# Altium project Logic_Gates_4.PrjPcb (part 1 of 2)
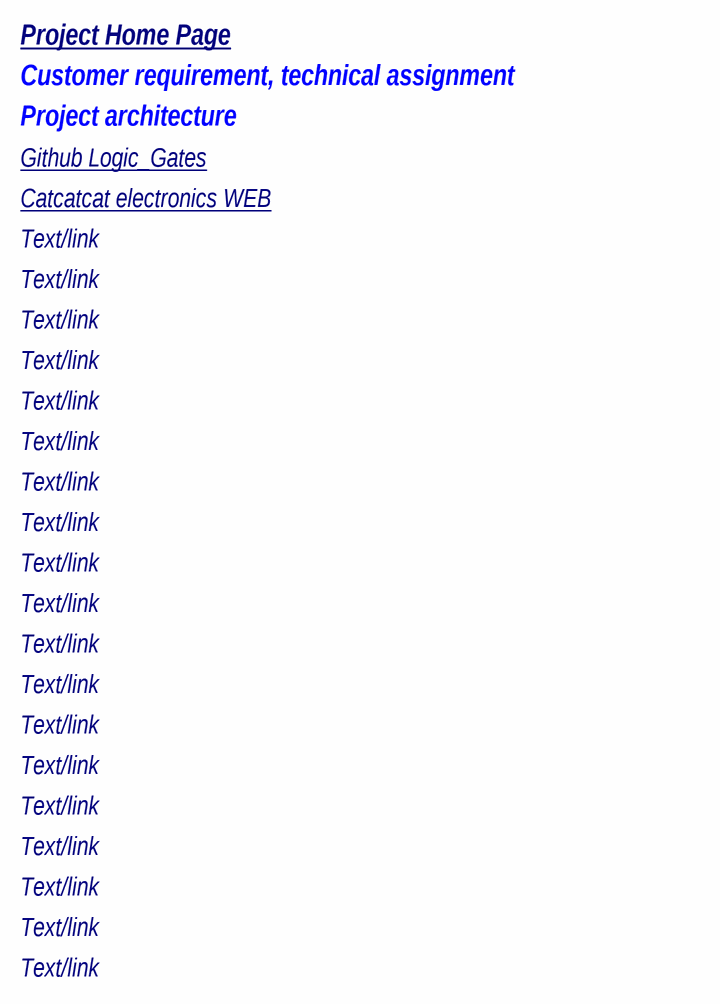
[diagram p0: Additional Documents.SchDoc]
Svia_covering: Tented; SSurfaceFinish: HASL (with lead); SSolderMaskColor: Green; SSilkscreeColor: While; SPCB_Qty: 5; SMaterialPCB: FR4-Standart TG 135-140; SFinisOverallThickness: 1.6; SboardOutlineTolerance: 0.2mm(Regular); PRJ_Year: 2024; PRJ_Version: 00B1; PRJ_Title: LogicGates4; PRJ_ID: =PRJ_Year+'-'+PRJ_Title+'-'+PRJ_Version+'-'+PCB_Name+'-R'+PCB_Revision; PCB_Revision: 04; PCB_Name: PCB; Note: Note; Lead_PRJ: Lead_Catcatcat; Inspection_PRJ: Ins_Catcatcat; Engineer_SCH: SCH_Catcatcat; Engineer_PCB: PCB_Catcatcat; Customer_PRJ: Catcatcat Etsy; AddressTelephone: +380 50 575-98-63; AddressEmail: catcatcat.electronics@gmail.com; AddressCompanyDeveloper: Catcatcat Electronics; AddressCompany: Ukraine, Dnipro, Avenue Mira
9 sheets, 163 parts. Net scope: hierarchical (ports join the sheet entries above them; power ports are global).
Board file: PCB.PcbDoc
Sheets:
  Additional Documents.SchDoc
  Assembly.SchDoc
  Table Of Contents.SchDoc
  Functional Diagram.SchDoc
    Display = Display.SchDoc
    MCU = MCU.SchDoc
    Touch Sensors = Touch Sensors.SchDoc
    Sound = Sound.SchDoc
    Power = USB Power.SchDoc

## Sheet Additional Documents.SchDoc: =ProjectName
size A3; CodePhone: +380505759863; Author: Hena Chernov; CompanyName: Catcatcat Electronics; Organization: Catcatcat Electronics; SheetNumber: 2; SheetTotal: 10; SheetDescription: Links to additional project documents.; Email: catcatcat.electronics@gmail.com

### Notes on the sheet
- Project Home Page <https://catcatcat.d-lan.dp.ua/>
- Project architecture
- Customer requirement, technical assignment
- Github Logic_Gates <https://github.com/CatcatcatElectronics/Logic_Gates>
- Catcatcat electronics WEB <https://catcatcat.d-lan.dp.ua/>
- Text/link
- Document's name/Назва документу (Document link)
- Note: Links to additional technical documents used in the project.
- Project Title:
- Project Version:
- Designed for:
- Lead Project
- Project ID:
- Development company
- Date:
- PCB Revision:
- PCB Name:
- Sheet Title:
- Assembly Variant:
- Time:
- Sheet
- of
- Engineer SCH:
- Engineer PCB:
- Inspection PRJ:
- Size: A3
- File:

## Sheet Assembly.SchDoc: =ProjectName
size A4; Author: Hena Chernov; CompanyName: Catcatcat Electronics; Engineer: Hena Chernov; Organization: Catcatcat Electronics; SheetNumber: 3; SheetTotal: 10; CodePhone: +380505759863; SheetDescription: Board Assembly Components
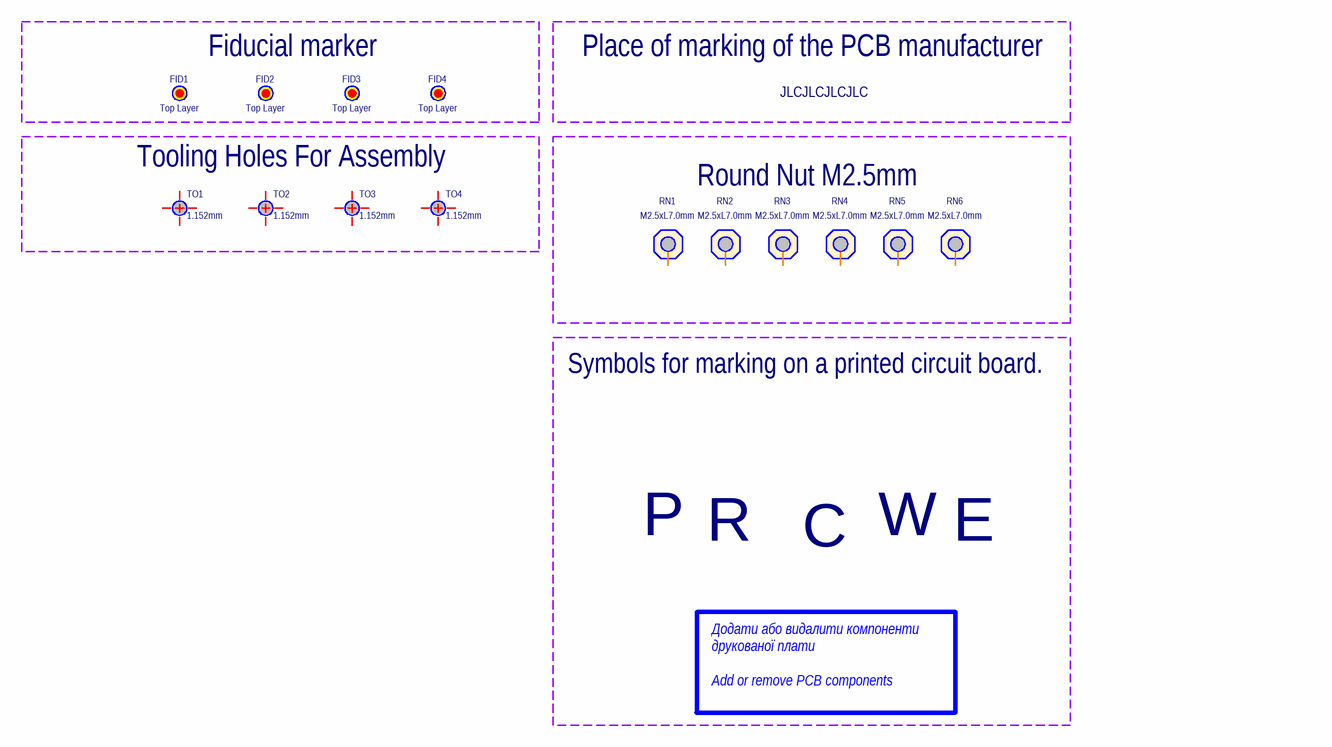
[diagram p1: Assembly.SchDoc]

### Parts
FID1  value Top Layer  [Fiducial marker top]  (hidden comment: Top(Bottom) Layer)  (no BOM)
FID2  value Top Layer  [Fiducial marker top]  (hidden comment: Top(Bottom) Layer)  (no BOM)
FID3  value Top Layer  [Fiducial marker top]  (hidden comment: Top(Bottom) Layer)  (no BOM)
FID4  value Top Layer  [Fiducial marker top]  (hidden comment: Top(Bottom) Layer)  (no BOM)
GS2  Graphic symbol  [_S_JLC]  (value not drawn)  (no BOM)
GS3  Graphic symbol  [_S_Pb-free]  (value not drawn)  (no BOM)
GS4  Graphic symbol  [_S_TR]  (value not drawn)  (no BOM)
GS5  Graphic symbol  [_S_R]  (value not drawn)  (no BOM)
GS6  Graphic symbol  [_S_ATTENTION2]  (value not drawn)  (no BOM)
GS7  Graphic symbol  [_S_CE]  (value not drawn)  (no BOM)
RN1  value M2.5xL7.0mm  [NUT2.5xL7.0]  (hidden comment: SMTSO2570CTJ)
RN2  value M2.5xL7.0mm  [NUT2.5xL7.0]  (hidden comment: SMTSO2570CTJ)
RN3  value M2.5xL7.0mm  [NUT2.5xL7.0]  (hidden comment: SMTSO2570CTJ)
RN4  value M2.5xL7.0mm  [NUT2.5xL7.0]  (hidden comment: SMTSO2570CTJ)
RN5  value M2.5xL7.0mm  [NUT2.5xL7.0]  (hidden comment: SMTSO2570CTJ)
RN6  value M2.5xL7.0mm  [NUT2.5xL7.0]  (hidden comment: SMTSO2570CTJ)
TO1  1.152mm  [Tooling_Holes_1.152MM]  (no BOM)
TO2  1.152mm  [Tooling_Holes_1.152MM]  (no BOM)
TO3  1.152mm  [Tooling_Holes_1.152MM]  (no BOM)
TO4  1.152mm  [Tooling_Holes_1.152MM]  (no BOM)

### Blocks framed on the sheet
Fiducial marker: FID1-FID4
Place of marking of the PCB manufacturer: GS2
Tooling Holes For Assembly: TO1-TO4
Round Nut M2.5mm: RN1-RN6
Symbols for marking on a printed circuit board.: GS3-GS7

### Nets

Not connected (* = marked no-connect by the designer): FID1 1; FID2 1; FID3 1; FID4 1; RN1 1; RN2 1; RN3 1; RN4 1; RN5 1; RN6 1; TO1 1; TO2 1; TO3 1; TO4 1

### Notes on the sheet
- Додати або видалити компоненти друкованої плати
  Add or remove PCB components
- Project Title:
- Project Version:
- Designed for:
- Lead Project
- Project ID:
- Development company
- Date:
- PCB Revision:
- PCB Name:
- Sheet Title:
- Assembly Variant:
- Time:
- Sheet
- of
- Engineer SCH:
- Engineer PCB:
- Inspection PRJ:
- Size: A4
- File:
- (in symbol _S_ATTENTION2) E
- (in symbol _S_JLC) JLCJLCJLCJLC
- (in symbol _S_PF) P
- (in symbol _S_R) R
- (in symbol _S_SE) C
- (in symbol _S_TR) W

### Library data of the parts
FID1-FID4 = Fiducial marker Top: For Assembly Top(Bottom) Layer; Assembly type: Fiducial Marker; Manufacturer Part Number 1: Fiducial Marker; Note: Fiducial marker; Case/Package: Fiducial Marker; Publisher: Catcatcat Electronics; Website developer: http://catcatcat.d-lan.dp.ua/; Footprint check status: Verified; Supplier URL 1: https://jlcpcb.com/parts/componentSearch?searchTxt=; Supplier 1: LCSC
GS2 = _S_JLC: Graphic symbol for marking on a PCB; Value: *; Assembly type: Graphic symbol; Note: Graphic symbol; Publisher: Catcatcat Electronics; Website developer: http://catcatcat.d-lan.dp.ua/; Footprint check status: Verified; Manufacturer Part Number 1: Graphic symbol; Case/Package: Graphic symbol; Supplier URL 1: https://jlcpcb.com/parts/componentSearch?searchTxt=
GS3 = _S_PF: Graphic symbol for marking on a PCB; Value: *; Assembly type: Graphic symbol; Note: Graphic symbol; Publisher: Catcatcat Electronics; Website developer: http://catcatcat.d-lan.dp.ua/; Footprint check status: Verified; Manufacturer Part Number 1: Graphic symbol; Case/Package: Graphic symbol; Supplier URL 1: https://jlcpcb.com/parts/componentSearch?searchTxt=
GS4 = _S_TR: Graphic symbol for marking on a PCB; Value: *; Assembly type: Graphic symbol; Note: Graphic symbol; Publisher: Catcatcat Electronics; Website developer: http://catcatcat.d-lan.dp.ua/; Footprint check status: Verified; Manufacturer Part Number 1: Graphic symbol; Case/Package: Graphic symbol; Supplier URL 1: https://jlcpcb.com/parts/componentSearch?searchTxt=
GS5 = _S_R: Graphic symbol for marking on a PCB; Value: *; Assembly type: Graphic symbol; Note: Graphic symbol; Publisher: Catcatcat Electronics; Website developer: http://catcatcat.d-lan.dp.ua/; Footprint check status: Verified; Manufacturer Part Number 1: Graphic symbol; Case/Package: Graphic symbol; Supplier URL 1: https://jlcpcb.com/parts/componentSearch?searchTxt=
GS6 = _S_ATTENTION2: Graphic symbol for marking on a PCB; Value: *; Assembly type: Graphic symbol; Note: Graphic symbol; Publisher: Catcatcat Electronics; Website developer: http://catcatcat.d-lan.dp.ua/; Footprint check status: Verified; Manufacturer Part Number 1: Graphic symbol; Case/Package: Graphic symbol; Supplier URL 1: https://jlcpcb.com/parts/componentSearch?searchTxt=
GS7 = _S_SE: Graphic symbol for marking on a PCB; Value: *; Assembly type: Graphic symbol; Note: Graphic symbol; Publisher: Catcatcat Electronics; Website developer: http://catcatcat.d-lan.dp.ua/; Footprint check status: Verified; Manufacturer Part Number 1: Graphic symbol; Case/Package: Graphic symbol; Supplier URL 1: https://jlcpcb.com/parts/componentSearch?searchTxt=
RN1-RN6 = Round Nut M2.5xL7.0S (E): Nuts Tinning Copper, M2.5 Round Nut L7.0mm; Manufacturer 1: Sinhoo; Detailed Description: Round Nut M2.5x5.56xLxx+1.53  Nuts ROHS; Assembly type: Extended Part; HelpURL: https://datasheet.lcsc.com/lcsc/2112061830_Sinhoo-SMTSO2570CTJ_C2916328.pdf; Manufacturer Part Number 1: SMTSO2570CTJ; Note: Round Nut; Case/Package: SMD-M2.5x5.56xLxx+1.53; Supplier Part Number 1: C2916328; Supplier Unit Price 1: 0.0965; Publisher: Catcatcat Electronics; Website developer: http://catcatcat.d-lan.dp.ua/; Footprint check status: Verified; Supplier URL 1: https://www.lcsc.com/product-detail/SMD-round-nut_Sinhoo-SMTSO2570CTJ_C2916328.html; Supplier 1: LCSC; MountType: SMD+TH
TO1-TO4 = Tooling_Holes_1.152MM: For Assembly; Note: Tooling Hole; Assembly type: Tooling Hole; Case/Package: Tooling Hole 1.152mm; Publisher: Catcatcat Electronics; Website developer: http://catcatcat.d-lan.dp.ua/; Footprint check status: Verified; Supplier URL 1: https://jlcpcb.com/parts/componentSearch?searchTxt=; Supplier 1: LCSC; Value: 1.152mm

## Sheet Table Of Contents.SchDoc: =ProjectName
size A4; CompanyName: Catcatcat Electronics; Engineer: Hena Chernov; Organization: Catcatcat Electronics; SheetNumber: 4; SheetTotal: 10; CodePhone: +380505759863; SheetDescription: List of project sheets.; Email: catcatcat.electronics@gmail.com
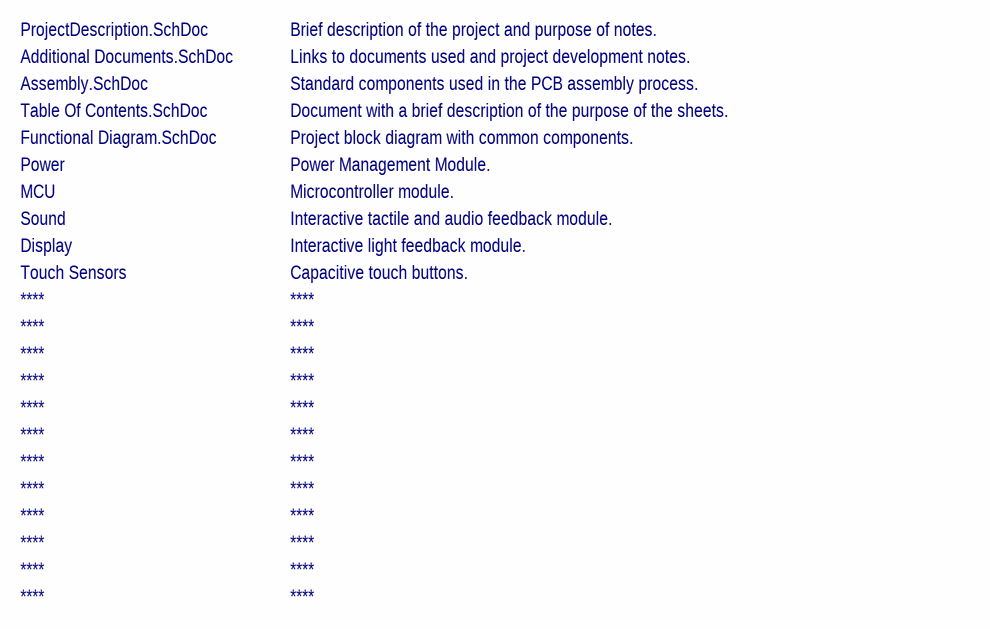
[diagram p2: Table Of Contents.SchDoc]

### Notes on the sheet
- Additional Documents.SchDoc
- ProjectDescription.SchDoc
- Links to documents used and project development notes.
- Brief description of the project and purpose of notes.
- Table Of Contents.SchDoc
- Assembly.SchDoc
- Document with a brief description of the purpose of the sheets.
- Standard components used in the PCB assembly process.
- Power
- MCU
- Functional Diagram.SchDoc
- Power Management Module.
- Microcontroller module.
- Project block diagram with common components.
- Sound
- Display
- Interactive tactile and audio feedback module.
- Interactive light feedback module.
- Touch Sensors
- ****
- Capacitive touch buttons.
- TABLE OF CONTENTS
- Sheet NO:
- Sheet name
- Notes
- 1
- 2
- 3
- 4
- 5
- 7
- 6
- 8
- 9
- 10
- 11
- 12
- 13
- 14
- 15
- 16
- 17
- 18
- 19
- 20
- 21
- 22
- Project Title:
- Project Version:
- Designed for:
- Lead Project
- Project ID:
- Development company
- Date:
- PCB Revision:
- PCB Name:
- Sheet Title:
- Assembly Variant:
- Time:
- Sheet
- of
- Engineer SCH:
- Engineer PCB:
- Inspection PRJ:
- Size: A4
- File:

## Sheet Functional Diagram.SchDoc: =ProjectName
size A3; Author: Hena Chernov; CompanyName: Catcatcat Electronics; Engineer: Hena Chernov; Organization: Catcatcat Electronics; SheetNumber: 5; SheetTotal: 10; CodePhone: +380505759863; SheetDescription: Project flowchart.; Email: catcatcat.electronics@gmail.com
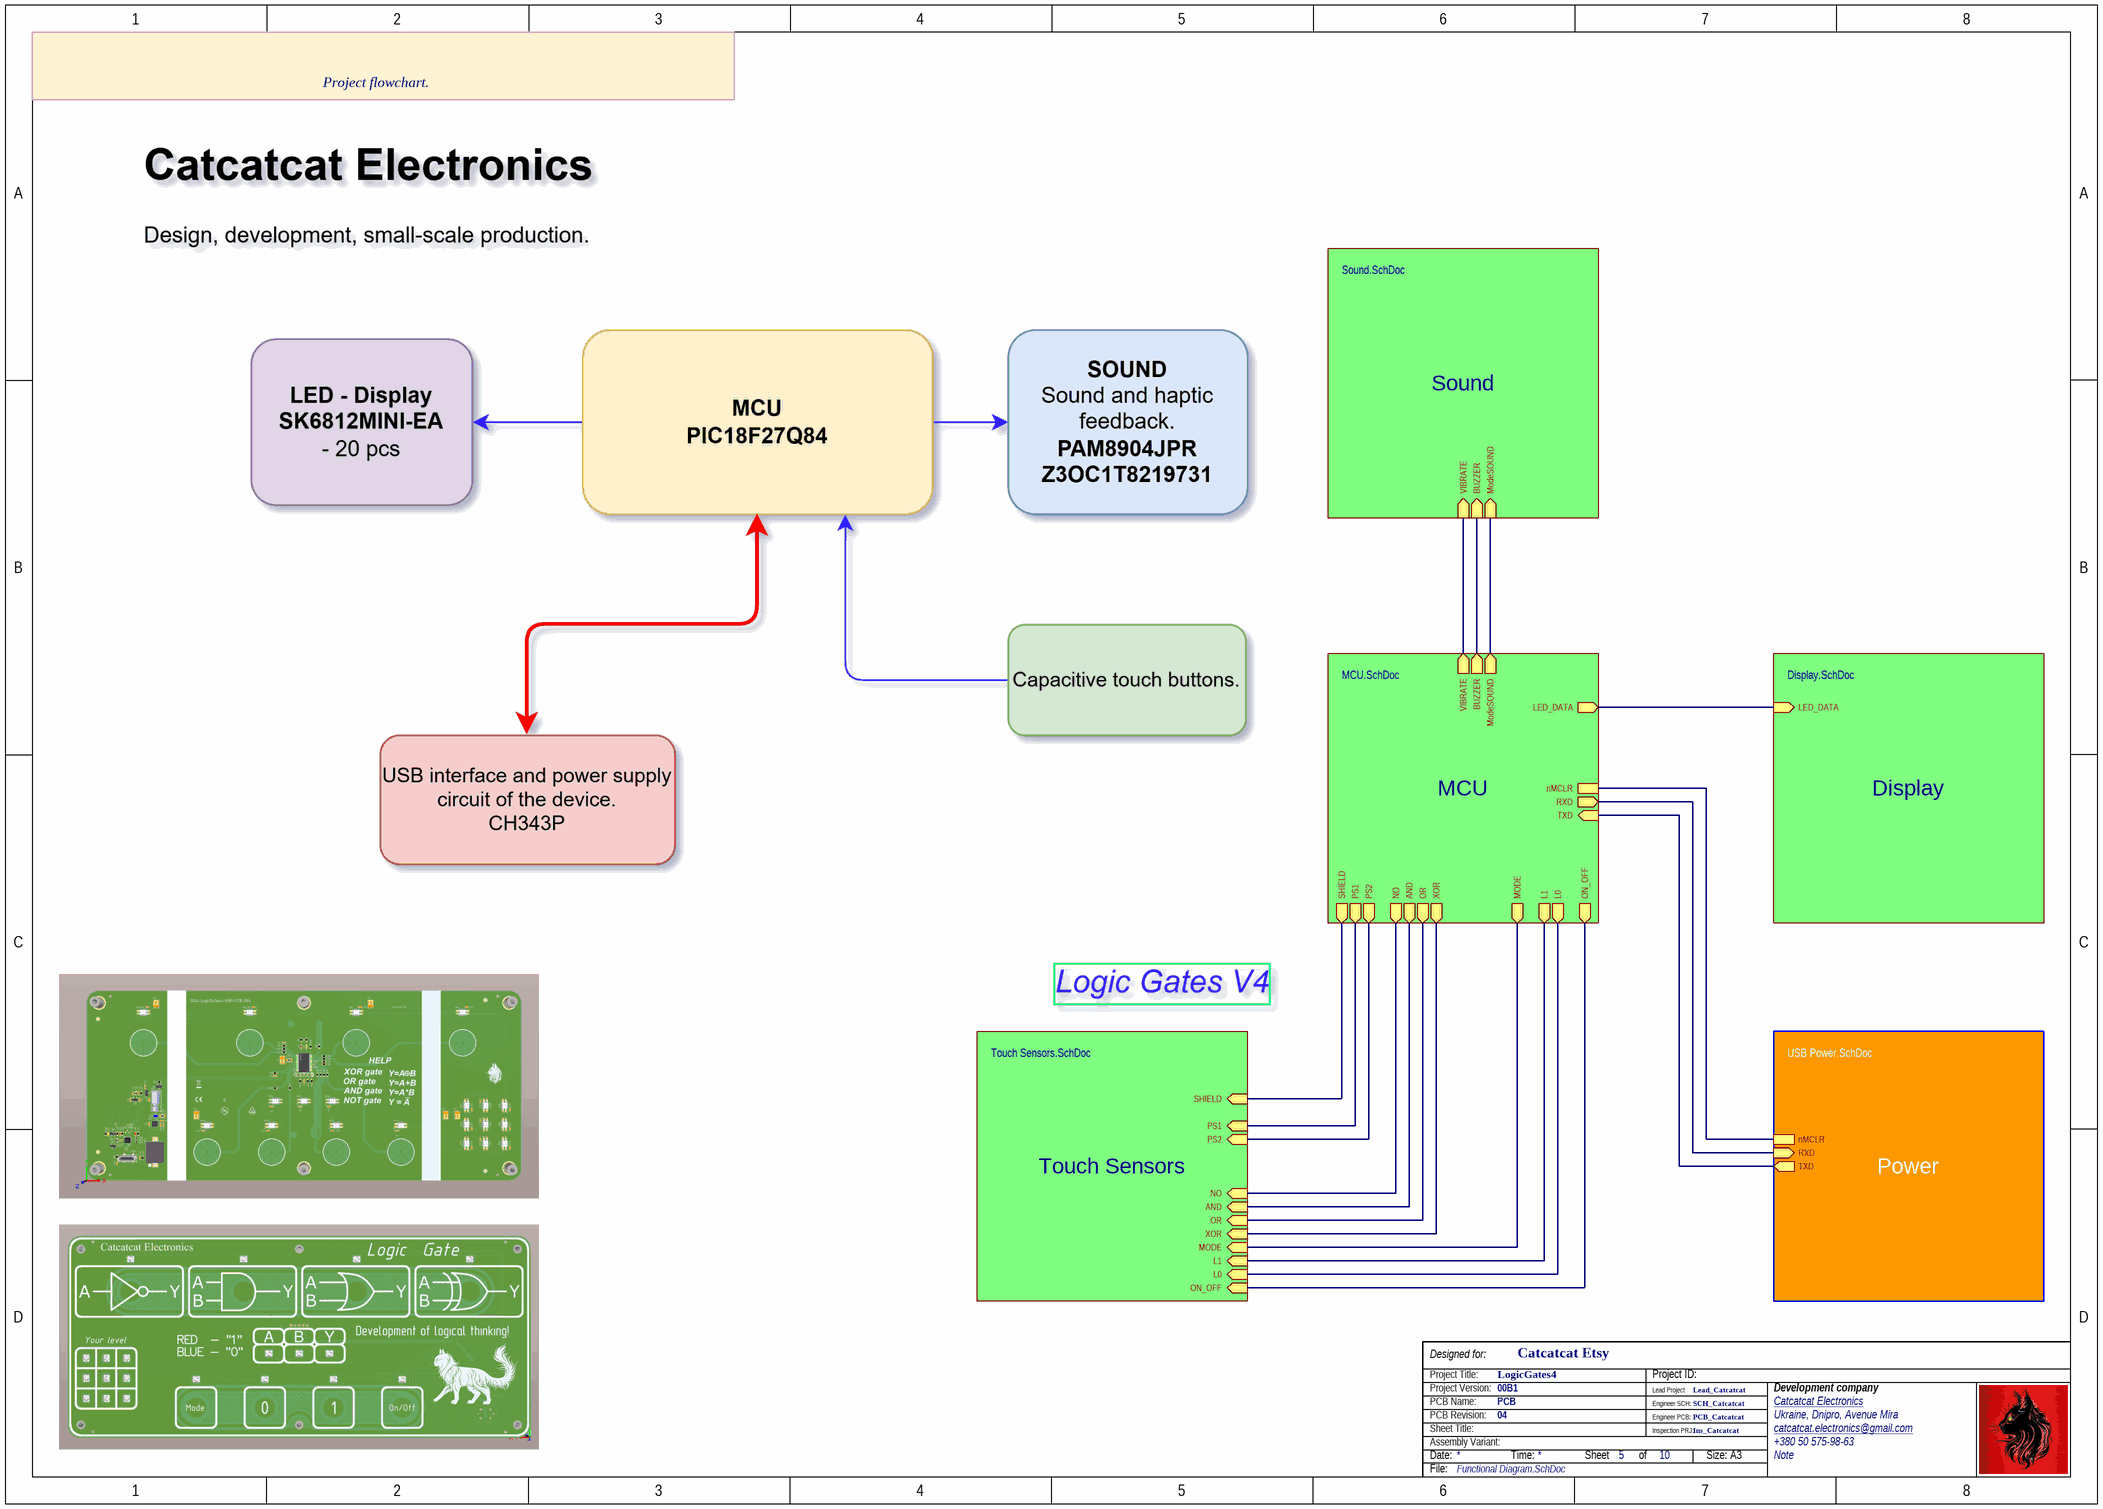
[diagram p3: Functional Diagram.SchDoc]

### Sub-sheets
Display = Display.SchDoc: LED_DATA (in)
MCU = MCU.SchDoc: BUZZER (out), VIBRATE (out), LED_DATA (out), NO (out), AND (out), OR (out), XOR (out), MODE (out), L1 (out), L0 (out), ON_OFF (out), SHIELD (out), PS1 (out), PS2 (out), ModeSOUND (out), nMCLR, RXD (out), TXD (in)
Power = USB Power.SchDoc: RXD (in), nMCLR, TXD (out)
Sound = Sound.SchDoc: BUZZER (in), VIBRATE (in), ModeSOUND (in)
Touch Sensors = Touch Sensors.SchDoc: NO (in), AND (in), OR (in), XOR (in), MODE (in), L1 (in), L0 (in), ON_OFF (in), SHIELD (in), PS1 (in), PS2 (in)

### Nets
AND: sheet MCU/AND, sheet Touch Sensors/AND
BUZZER: sheet MCU/BUZZER, sheet Sound/BUZZER
L0: sheet MCU/L0, sheet Touch Sensors/L0
L1: sheet MCU/L1, sheet Touch Sensors/L1
LED_DATA: sheet Display/LED_DATA, sheet MCU/LED_DATA
MODE: sheet MCU/MODE, sheet Touch Sensors/MODE
ModeSOUND: sheet MCU/ModeSOUND, sheet Sound/ModeSOUND
nMCLR: sheet MCU/nMCLR, sheet Power/nMCLR
NO: sheet MCU/NO, sheet Touch Sensors/NO
ON_OFF: sheet MCU/ON_OFF, sheet Touch Sensors/ON_OFF
OR: sheet MCU/OR, sheet Touch Sensors/OR
PS1: sheet MCU/PS1, sheet Touch Sensors/PS1
PS2: sheet MCU/PS2, sheet Touch Sensors/PS2
RXD: sheet MCU/RXD, sheet Power/RXD
SHIELD: sheet MCU/SHIELD, sheet Touch Sensors/SHIELD
TXD: sheet MCU/TXD, sheet Power/TXD
VIBRATE: sheet MCU/VIBRATE, sheet Sound/VIBRATE
XOR: sheet MCU/XOR, sheet Touch Sensors/XOR

### Notes on the sheet
- Project Title:
- Project Version:
- Designed for:
- Lead Project
- Project ID:
- Development company
- Date:
- PCB Revision:
- PCB Name:
- Sheet Title:
- Assembly Variant:
- Time:
- Sheet
- of
- Engineer SCH:
- Engineer PCB:
- Inspection PRJ:
- Size: A3
- File:

## Sheet Display.SchDoc: =SheetTitle
size A4; CompanyName: Catcatcat Electronics; Engineer: Hena Chernov; Organization: Catcatcat Electronics; SheetNumber: 8; SheetTotal: 10; CodePhone: +380505759863; SheetDescription: Interactive light feedback module.; Email: catcatcat.electronics@gmail.com
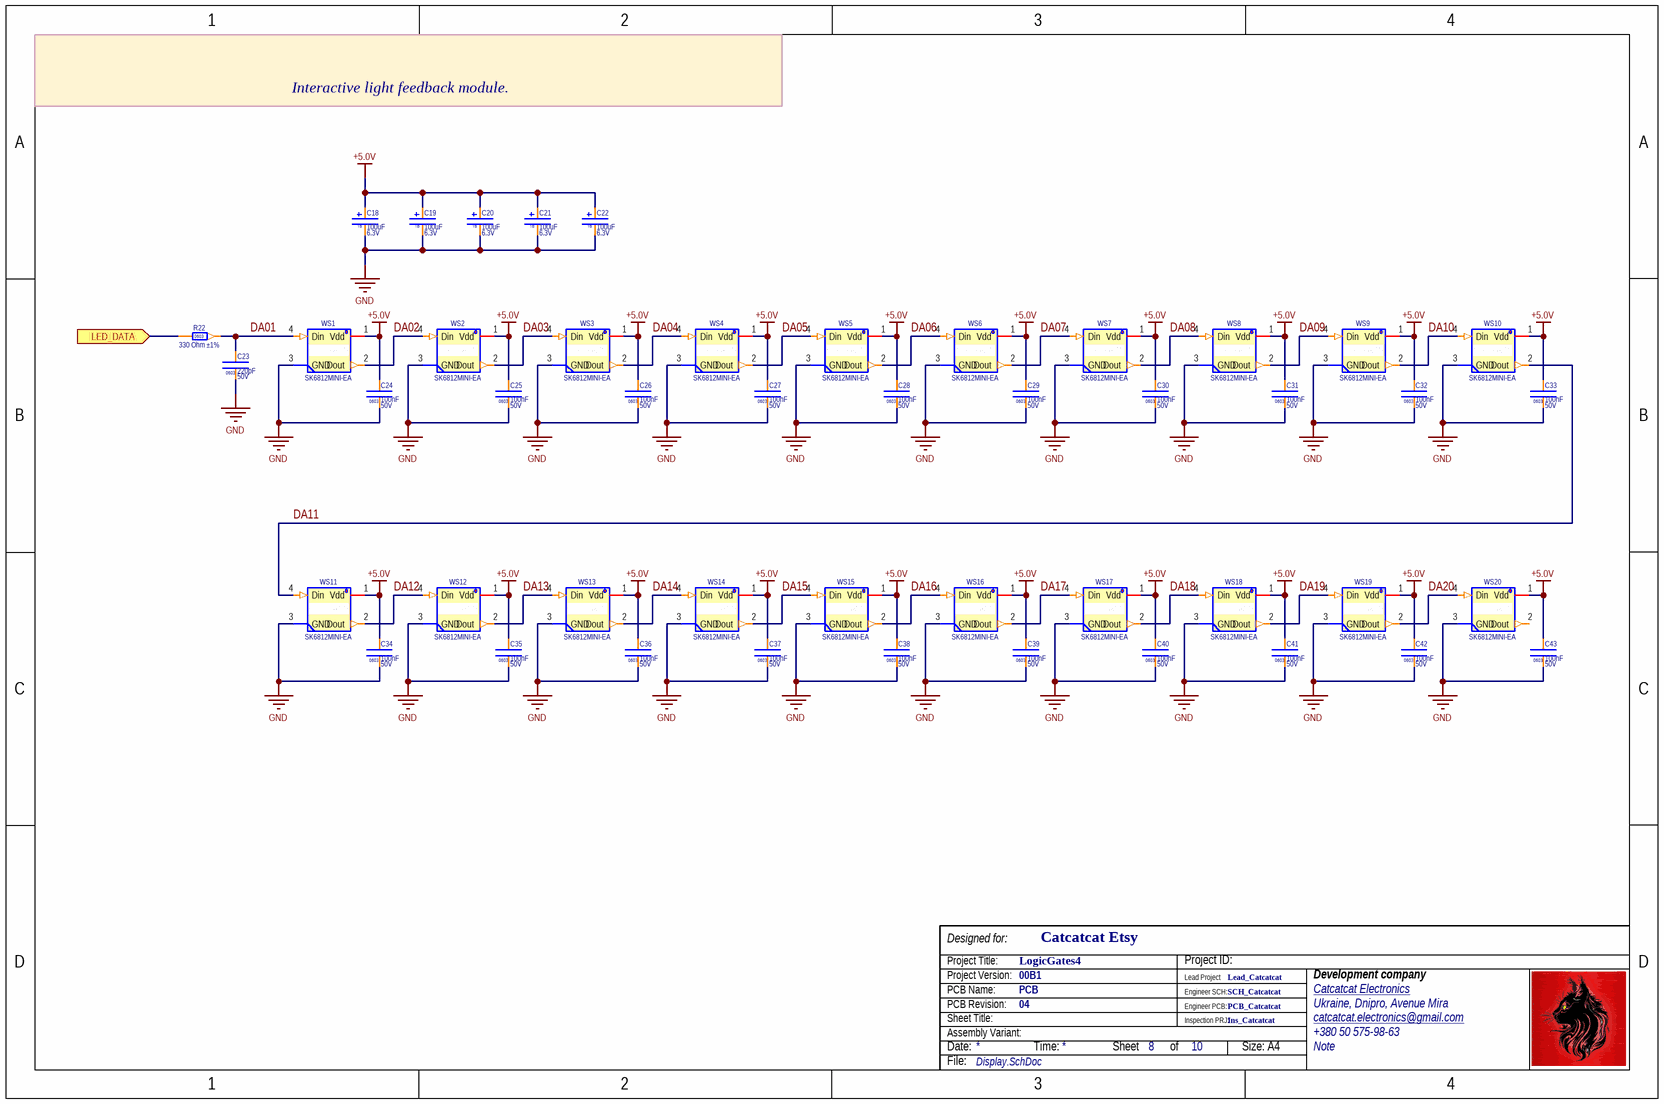
[diagram p4: Display.SchDoc]

### Parts
C18  value 100uF  Voltage: 6.3V  [TANTAL_B]  (hidden comment: 100UF 6.3V CASE-B_3528)
C19  value 100uF  Voltage: 6.3V  [TANTAL_B]  (hidden comment: 100UF 6.3V CASE-B_3528)
C20  value 100uF  Voltage: 6.3V  [TANTAL_B]  (hidden comment: 100UF 6.3V CASE-B_3528)
C21  value 100uF  Voltage: 6.3V  [TANTAL_B]  (hidden comment: 100UF 6.3V CASE-B_3528)
C22  value 100uF  Voltage: 6.3V  [TANTAL_B]  (hidden comment: 100UF 6.3V CASE-B_3528)
C23  value 220pF  Voltage: 50V  [CC0603(1608)x0.8]  (hidden comment: 220 pF ±10%)
C24  value 100nF  Voltage: 50V  [CC0603(1608)x0.8]  (hidden comment: 100 nF ±10% 50V)
C25  value 100nF  Voltage: 50V  [CC0603(1608)x0.8]  (hidden comment: 100 nF ±10% 50V)
C26  value 100nF  Voltage: 50V  [CC0603(1608)x0.8]  (hidden comment: 100 nF ±10% 50V)
C27  value 100nF  Voltage: 50V  [CC0603(1608)x0.8]  (hidden comment: 100 nF ±10% 50V)
C28  value 100nF  Voltage: 50V  [CC0603(1608)x0.8]  (hidden comment: 100 nF ±10% 50V)
C29  value 100nF  Voltage: 50V  [CC0603(1608)x0.8]  (hidden comment: 100 nF ±10% 50V)
C30  value 100nF  Voltage: 50V  [CC0603(1608)x0.8]  (hidden comment: 100 nF ±10% 50V)
C31  value 100nF  Voltage: 50V  [CC0603(1608)x0.8]  (hidden comment: 100 nF ±10% 50V)
C32  value 100nF  Voltage: 50V  [CC0603(1608)x0.8]  (hidden comment: 100 nF ±10% 50V)
C33  value 100nF  Voltage: 50V  [CC0603(1608)x0.8]  (hidden comment: 100 nF ±10% 50V)
C34  value 100nF  Voltage: 50V  [CC0603(1608)x0.8]  (hidden comment: 100 nF ±10% 50V)
C35  value 100nF  Voltage: 50V  [CC0603(1608)x0.8]  (hidden comment: 100 nF ±10% 50V)
C36  value 100nF  Voltage: 50V  [CC0603(1608)x0.8]  (hidden comment: 100 nF ±10% 50V)
C37  value 100nF  Voltage: 50V  [CC0603(1608)x0.8]  (hidden comment: 100 nF ±10% 50V)
C38  value 100nF  Voltage: 50V  [CC0603(1608)x0.8]  (hidden comment: 100 nF ±10% 50V)
C39  value 100nF  Voltage: 50V  [CC0603(1608)x0.8]  (hidden comment: 100 nF ±10% 50V)
C40  value 100nF  Voltage: 50V  [CC0603(1608)x0.8]  (hidden comment: 100 nF ±10% 50V)
C41  value 100nF  Voltage: 50V  [CC0603(1608)x0.8]  (hidden comment: 100 nF ±10% 50V)
C42  value 100nF  Voltage: 50V  [CC0603(1608)x0.8]  (hidden comment: 100 nF ±10% 50V)
C43  value 100nF  Voltage: 50V  [CC0603(1608)x0.8]  (hidden comment: 100 nF ±10% 50V)
R22  value 330 Ohm ±1%  [RC0603(1608) -1%]  (hidden comment: 330 R ±1%)
WS1  SK6812MINI-EA  [SK6812MINI-EA - 1MM]
WS2  SK6812MINI-EA  [SK6812MINI-EA - 1MM]
WS3  SK6812MINI-EA  [SK6812MINI-EA - 1MM]
WS4  SK6812MINI-EA  [SK6812MINI-EA - 1MM]
WS5  SK6812MINI-EA  [SK6812MINI-EA - 1MM]
WS6  SK6812MINI-EA  [SK6812MINI-EA - 1MM]
WS7  SK6812MINI-EA  [SK6812MINI-EA - 1MM]
WS8  SK6812MINI-EA  [SK6812MINI-EA - 1MM]
WS9  SK6812MINI-EA  [SK6812MINI-EA - 1MM]
WS10  SK6812MINI-EA  [SK6812MINI-EA - 1MM]
WS11  SK6812MINI-EA  [SK6812MINI-EA - 1MM]
WS12  SK6812MINI-EA  [SK6812MINI-EA - 1MM]
WS13  SK6812MINI-EA  [SK6812MINI-EA - 1MM]
WS14  SK6812MINI-EA  [SK6812MINI-EA - 1MM]
WS15  SK6812MINI-EA  [SK6812MINI-EA - 1MM]
WS16  SK6812MINI-EA  [SK6812MINI-EA - 1MM]
WS17  SK6812MINI-EA  [SK6812MINI-EA - 1MM]
WS18  SK6812MINI-EA  [SK6812MINI-EA - 1MM]
WS19  SK6812MINI-EA  [SK6812MINI-EA - 1MM]
WS20  SK6812MINI-EA  [SK6812MINI-EA - 1MM]

### Ports
LED_DATA (in)

### Nets
+5.0V: C18.1 C19.1 C20.1 C21.1 C22.1 C24.2 C25.2 C26.2 C27.2 C28.2 C29.2 C30.2 C31.2 C32.2 C33.2 C34.2 C35.2 C36.2 C37.2 C38.2 C39.2 C40.2 C41.2 C42.2 C43.2 WS1.1(Vdd) WS2.1(Vdd) WS3.1(Vdd) WS4.1(Vdd) WS5.1(Vdd) WS6.1(Vdd) WS7.1(Vdd) WS8.1(Vdd) WS9.1(Vdd) WS10.1(Vdd) WS11.1(Vdd) WS12.1(Vdd) WS13.1(Vdd) WS14.1(Vdd) WS15.1(Vdd) WS16.1(Vdd) WS17.1(Vdd) WS18.1(Vdd) WS19.1(Vdd) WS20.1(Vdd)
GND: C18.2 C19.2 C20.2 C21.2 C22.2 C23.1 C24.1 C25.1 C26.1 C27.1 C28.1 C29.1 C30.1 C31.1 C32.1 C33.1 C34.1 C35.1 C36.1 C37.1 C38.1 C39.1 C40.1 C41.1 C42.1 C43.1 WS1.3(GND) WS2.3(GND) WS3.3(GND) WS4.3(GND) WS5.3(GND) WS6.3(GND) WS7.3(GND) WS8.3(GND) WS9.3(GND) WS10.3(GND) WS11.3(GND) WS12.3(GND) WS13.3(GND) WS14.3(GND) WS15.3(GND) WS16.3(GND) WS17.3(GND) WS18.3(GND) WS19.3(GND) WS20.3(GND)
DA01: C23.2 R22.2 WS1.4(Din)
DA02: WS1.2(Dout) WS2.4(Din)
DA03: WS2.2(Dout) WS3.4(Din)
DA04: WS3.2(Dout) WS4.4(Din)
DA05: WS4.2(Dout) WS5.4(Din)
DA06: WS5.2(Dout) WS6.4(Din)
DA07: WS6.2(Dout) WS7.4(Din)
DA08: WS7.2(Dout) WS8.4(Din)
DA09: WS8.2(Dout) WS9.4(Din)
DA10: WS9.2(Dout) WS10.4(Din)
DA11: WS10.2(Dout) WS11.4(Din)
DA12: WS11.2(Dout) WS12.4(Din)
DA13: WS12.2(Dout) WS13.4(Din)
DA14: WS13.2(Dout) WS14.4(Din)
DA15: WS14.2(Dout) WS15.4(Din)
DA16: WS15.2(Dout) WS16.4(Din)
DA17: WS16.2(Dout) WS17.4(Din)
DA18: WS17.2(Dout) WS18.4(Din)
DA19: WS18.2(Dout) WS19.4(Din)
DA20: WS19.2(Dout) WS20.4(Din)
LED_DATA: R22.1 ; port LED_DATA

Not connected (* = marked no-connect by the designer): WS20 2(Dout)

### Notes on the sheet
- Project Title:
- Project Version:
- Designed for:
- Lead Project
- Project ID:
- Development company
- Date:
- PCB Revision:
- PCB Name:
- Sheet Title:
- Assembly Variant:
- Time:
- Sheet
- of
- Engineer SCH:
- Engineer PCB:
- Inspection PRJ:
- Size: A4
- File:
- (in symbol TANTAL-B 100uF 6.3V (B)) TB

### Library data of the parts
C18-C22 = TANTAL-B 100uF 6.3V (B): Tantalum Capacitors 100uF 6.3V CASE-B_3528 RoHS; Manufacturer 1: AVX; Manufacturer Part Number 1: TAJB107K006RNJ; Lifetime @ Temp: 2000Hrs@105℃; Case/Package: CASE-B_3528; Publisher: Catcatcat Electronics; Note: Tantalum Capacitors; HelpURL: https://datasheet.lcsc.com/szlcsc/AVX-TAJB107K006RNJ_C16133.pdf; website developer: http://catcatcat.d-lan.dp.ua/; Detailed Description: Tantalum Capacitors 100uF 6.3V CASE-B_3528 RoHS; Supplier URL 1: https://jlcpcb.com/parts/componentSearch?searchTxt=; Supplier Part Number 1: C16133; Supplier Unit Price 1: 0.1177; Assembly type: Basic Part; Footprint check status: Verified; QuantityElements: 1; Supplier 1: LCSC; MountType: SMD
C23 = 0603 0.000220 uF (B): 220 pF ±10% 50V X7R; Manufacturer 1: Samsung Electro-Mechanics; Manufacturer Part Number 1: CL10B221KB8NNNC; Note: Ceramic Capacitors; Detailed Description: 50V 220pF X7R ±10% 0603  Multilayer Ceramic Capacitors MLCC - SMD/SMT ROHS; Case/Package: 0603; Publisher: Catcatcat Electronics; Tolerance: ±10%; HelpURL: https://datasheet.lcsc.com/lcsc/1810261515_Samsung-Electro-Mechanics-CL10B221KB8NNNC_C1603.pdf; website developer: http://catcatcat.d-lan.dp.ua/; Temperature Coefficient: X7R; Supplier URL 1: https://jlcpcb.com/parts/componentSearch?searchTxt=; Operating Temperature: -55C to +125C; Supplier Part Number 1: C1603; Supplier Unit Price 1: 0.0074; Assembly type: Basic Part; Footprint check status: Verified; QuantityElements: 1; Supplier 1: LCSC; MountType: SMD
C24-C43 = 0603 0.1 uF (B): 100 nF ±10% 50V X7R; Manufacturer 1: YAGEO; Manufacturer Part Number 1: CC0603KRX7R9BB104; Note: Ceramic Capacitors; Detailed Description: 50V 100nF X7R ±10% 0603  Multilayer Ceramic Capacitors MLCC - SMD/SMT ROHS; Case/Package: 0603; Publisher: Catcatcat Electronics; Tolerance: ±10%; HelpURL: https://datasheet.lcsc.com/lcsc/1809301912_YAGEO-CC0603KRX7R9BB104_C14663.pdf; website developer: http://catcatcat.d-lan.dp.ua/; Temperature Coefficient: X7R; Supplier URL 1: https://jlcpcb.com/parts/componentSearch?searchTxt=; Operating Temperature: -55C to +125C; Supplier Part Number 1: C14663; Supplier Unit Price 1: 0.0021; Assembly type: Basic Part; Footprint check status: Verified; QuantityElements: 1; Supplier 1: LCSC; MountType: SMD
R22 = 0603 330 Ohm ±1% (B): 330 R (331) ±5% 1/10W 50V; Manufacturer 1: Uniroyal Elec; Manufacturer Part Number 1: 0603WAF3300T5E; Note: Chip Resistor - Surface Mount; Temperature Coefficient: ±100ppm/°C; Detailed Description: CHIP RESISTOR - SURFACE MOUNT 330OHMS ±1% 1/10W 0603 ROHS; Publisher: Catcatcat Electronics; Tolerance: ±1%; Voltage: 50V; HelpURL: https://datasheet.lcsc.com/szlcsc/Uniroyal-Elec-0603WAF3300T5E_C23138.pdf; Website Developer: http://catcatcat.d-lan.dp.ua/; Power (Watts): 1/10W; Supplier URL 1: https://jlcpcb.com/parts/componentSearch?searchTxt=; Manufacturer URL: http://uniohm.com/; Operating Temperature: -55°C ~ 155°C; Supplier Part Number 1: C23138; Supplier Unit Price 1: 0.0019; Assembly type: Basic Part; Footprint check status: Verified; QuantityElements: 1; Supplier 1: LCSC; MountType: SMD; Case/Package: 0603
WS1-WS20 = SK6812MINI-EA (E): TTB 12mA 5.2V -40℃~+80℃ RGB LEDs(Built-in IC); Manufacturer 1: OPSCO Optoelectronics; Note: IN THE HOLE OF THE PCB; Temp.Characteristic: -40C to +85C; Voltage: +3.7~+5.3V; Detailed Description: 12mA 5.2V -40℃~+80℃ RGB SMD  Light Emitting Diodes (LED) ROHS; Data Protocol: NRZ; Data structure: GRB 24bit; Case/Package: SMD; Publisher: Catcatcat Electronics; Manufacturer Part Number 1: SK6812MINI-EA; Supplier Part Number 1: C5378731; Supplier Unit Price 1: 0.1573; HelpURL: https://datasheet.lcsc.com/lcsc/2304101800_OPSCO-Optoelectronics-SK6812MINI-EA_C5378731.pdf; Website developer: http://catcatcat.d-lan.dp.ua/; Assembly type: Extended Part; Supplier URL 1: https://www.lcsc.com/product-detail/Light-Emitting-Diodes-LED_OPSCO-Optoelectronics-SK6812MINI-EA_C5378731.html; Footprint check status: Verified; QuantityElements: 1; Supplier 1: LCSC; Value: SK6812MINI-EA; MountType: SMD

## Sheet MCU.SchDoc: =SheetTitle
size A3; CompanyName: Catcatcat Electronics; Engineer: Hena Chernov; Organization: Catcatcat Electronics; SheetNumber: 6; SheetTotal: 10; CodePhone: +380505759863; SheetDescription: Microcontroller connection schematic.; Email: catcatcat.electronics@gmail.com
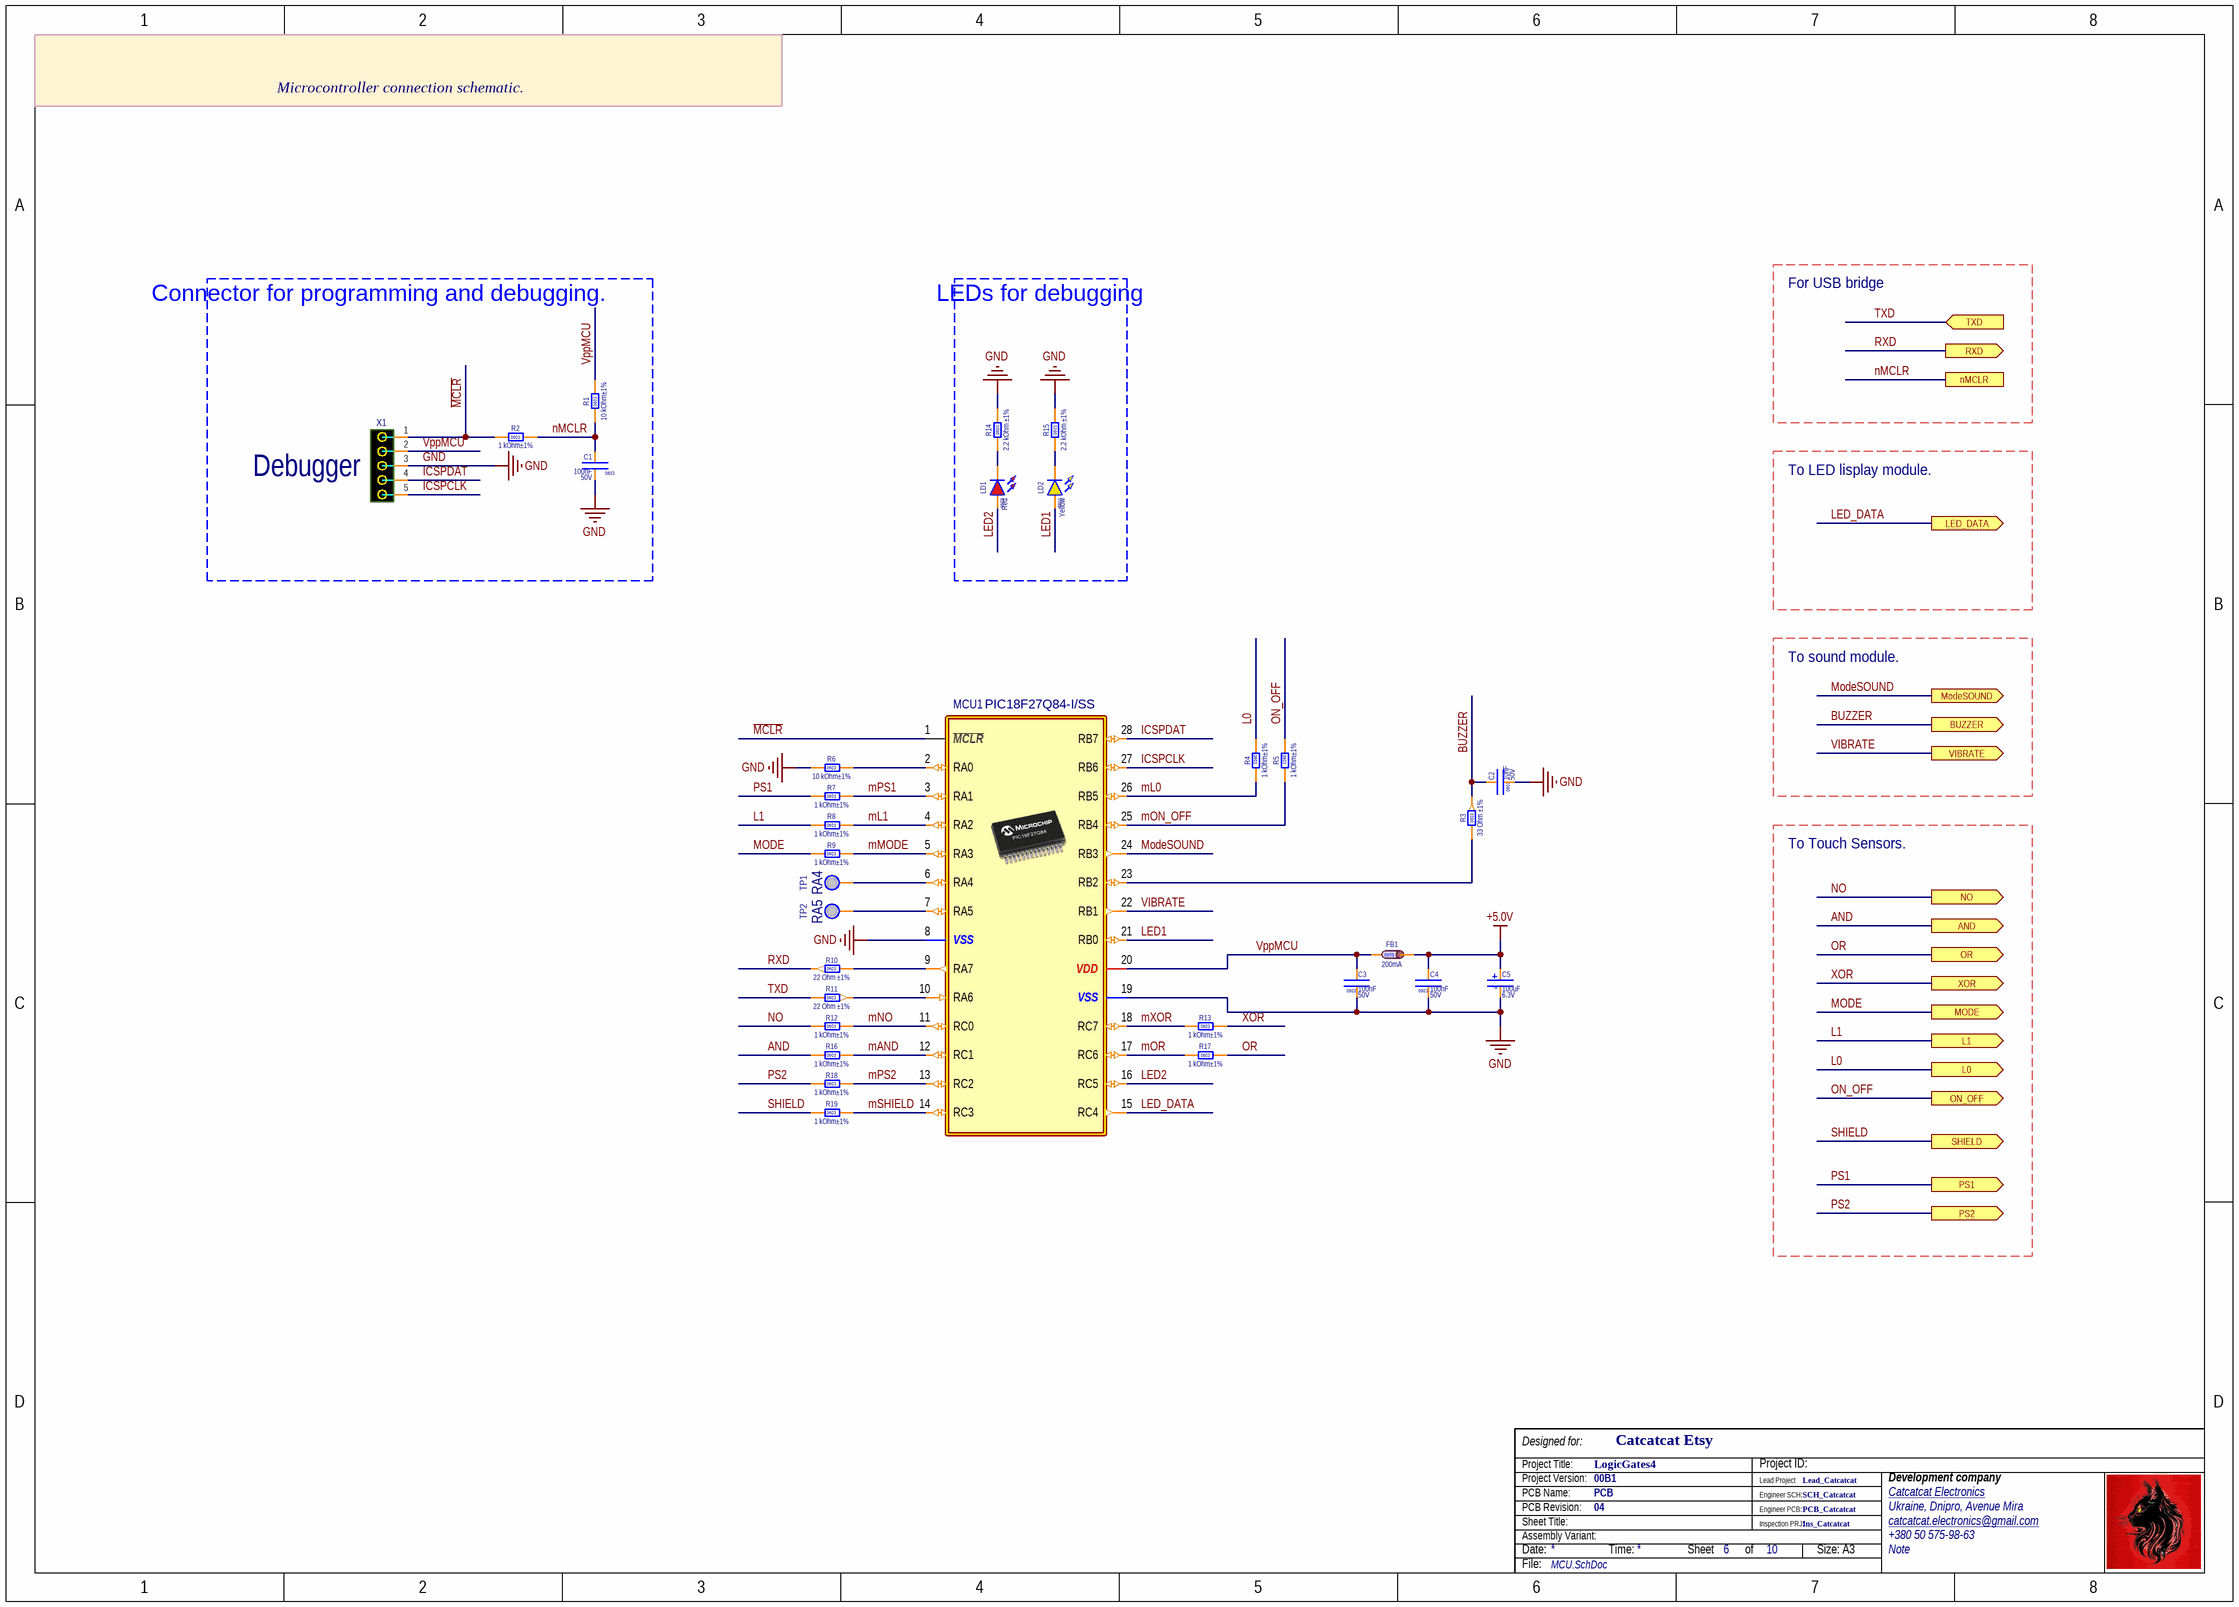
[diagram p5: MCU.SchDoc]

### Parts
C1  value 100nF  Voltage: 50V  [CC0603(1608)x0.8]  (hidden comment: 100 nF ±10% 50V)
C2  value 10nF  Voltage: 50V  [CC0603(1608)x0.8]  (hidden comment: 10 nF ±10% 50V)
C3  value 100nF  Voltage: 50V  [CC0603(1608)x0.8]  (hidden comment: 100 nF ±10% 50V)
C4  value 100nF  Voltage: 50V  [CC0603(1608)x0.8]  (hidden comment: 100 nF ±10% 50V)
C5  value 100uF  Voltage: 6.3V  [TANTAL_B]  (hidden comment: 100UF 6.3V CASE-B_3528)
FB1  value 200mA  [FB0603(1608)]  (hidden comment: GZ1608D601TF)
LD1  value Red  Case/Package: 0603  [LD0603 RED]  (hidden comment: KT-0603R)
LD2  value Yellow  Case/Package: 0603  [LD0603 YELLOW]  (hidden comment: LED 0603 Yellow 120° 60mW)
MCU1  PIC18F27Q84-I/SS  [FP-C04-073-IPC_C]
R1  value 10 kOhm±1%  [RC0603(1608) -1%]  (hidden comment: 10K ±1% 0603)
R2  value 1 kOhm±1%  [RC0603(1608) -1%]  (hidden comment: 1K ±1% 0603)
R3  value 33 Ohm ±1%  [RC0603(1608) -1%]  (hidden comment: 33R ±1% 0603)
R4  value 1 kOhm±1%  [RC0603(1608) -1%]  (hidden comment: 1K ±1% 0603)
R5  value 1 kOhm±1%  [RC0603(1608) -1%]  (hidden comment: 1K ±1% 0603)
R6  value 10 kOhm±1%  [RC0603(1608) -1%]  (hidden comment: 10K ±1% 0603)
R7  value 1 kOhm±1%  [RC0603(1608) -1%]  (hidden comment: 1K ±1% 0603)
R8  value 1 kOhm±1%  [RC0603(1608) -1%]  (hidden comment: 1K ±1% 0603)
R9  value 1 kOhm±1%  [RC0603(1608) -1%]  (hidden comment: 1K ±1% 0603)
R10  value 22 Ohm ±1%  [RC0603(1608) -1%]  (hidden comment: 22R ±1% 0603)
R11  value 22 Ohm ±1%  [RC0603(1608) -1%]  (hidden comment: 22R ±1% 0603)
R12  value 1 kOhm±1%  [RC0603(1608) -1%]  (hidden comment: 1K ±1% 0603)
R13  value 1 kOhm±1%  [RC0603(1608) -1%]  (hidden comment: 1K ±1% 0603)
R14  value 2.2 kOhm ±1%  [RC0603(1608) -1%]  (hidden comment: 2.2K ±1% 0603)
R15  value 2.2 kOhm ±1%  [RC0603(1608) -1%]  (hidden comment: 2.2K ±1% 0603)
R16  value 1 kOhm±1%  [RC0603(1608) -1%]  (hidden comment: 1K ±1% 0603)
R17  value 1 kOhm±1%  [RC0603(1608) -1%]  (hidden comment: 1K ±1% 0603)
R18  value 1 kOhm±1%  [RC0603(1608) -1%]  (hidden comment: 1K ±1% 0603)
R19  value 1 kOhm±1%  [RC0603(1608) -1%]  (hidden comment: 1K ±1% 0603)
TP1  RA4  [Test_Point_T_0.6mm]  (no BOM)
TP2  RA5  [Test_Point_T_0.6mm]  (no BOM)
X1  PL2N-05n  [PL2N-05]  (value not drawn)

### Blocks framed on the sheet
Debugger: C1 R1 R2 X1
LEDs for debugging: LD1 LD2 R14 R15

### Ports
AND (out), BUZZER (out), L0 (out), L1 (out), LED_DATA (out), MODE (out), ModeSOUND (out), nMCLR, NO (out), ON_OFF (out), OR (out), PS1 (out), PS2 (out), RXD (out), SHIELD (out), TXD (in), VIBRATE (out), XOR (out)

### Nets
+5.0V: C4.2 C5.1 FB1.1
GND: C1.1 C2.1 C3.1 C4.1 C5.2 MCU1.8(VSS) MCU1.19(VSS) R6.1 R14.1 R15.1 X1.3
~{MCLR}: MCU1.1(~{MCLR}) R2.2 X1.1
AND: R16.2 ; port AND
BUZZER: C2.2 R3.2 ; port BUZZER
ICSPCLK: MCU1.27(RB6) X1.5
ICSPDAT: MCU1.28(RB7) X1.4
L0: R4.1 ; port L0
L1: R8.1 ; port L1
LED1: LD2.2 MCU1.21(RB0)
LED2: LD1.2 MCU1.16(RC5)
LED_DATA: MCU1.15(RC4) ; port LED_DATA
mAND: MCU1.12(RC1) R16.1
mL0: MCU1.26(RB5) R4.2
mL1: MCU1.4(RA2) R8.2
mMODE: MCU1.5(RA3) R9.1
mNO: MCU1.11(RC0) R12.1
MODE: R9.2 ; port MODE
ModeSOUND: MCU1.24(RB3) ; port ModeSOUND
mON_OFF: MCU1.25(RB4) R5.2
mOR: MCU1.17(RC6) R17.1
mPS1: MCU1.3(RA1) R7.2
mPS2: MCU1.13(RC2) R18.1
mSHIELD: MCU1.14(RC3) R19.2
mXOR: MCU1.18(RC7) R13.1
nMCLR: C1.2 R1.1 R2.1 ; port nMCLR
NO: R12.2 ; port NO
ON_OFF: R5.1 ; port ON_OFF
OR: R17.2 ; port OR
PS1: R7.1 ; port PS1
PS2: R18.2 ; port PS2
RXD: R10.1 ; port RXD
SHIELD: R19.1 ; port SHIELD
TXD: R11.1 ; port TXD
VIBRATE: MCU1.22(RB1) ; port VIBRATE
VppMCU: C3.2 FB1.2 MCU1.20(VDD) R1.2 X1.2
XOR: R13.2 ; port XOR
NetLD1_1: LD1.1 R14.2
NetLD2_1: LD2.1 R15.2
NetMCU1_2: MCU1.2(RA0) R6.2
NetMCU1_6: MCU1.6(RA4) TP1.1
NetMCU1_7: MCU1.7(RA5) TP2.1
NetMCU1_9: MCU1.9(RA7) R10.2
NetMCU1_10: MCU1.10(RA6) R11.2
NetMCU1_23: MCU1.23(RB2) R3.1

### Notes on the sheet
- Connector for programming and debugging.
- For USB bridge
- To LED lisplay module.
- To sound module.
- To Touch Sensors.
- Project Title:
- Project Version:
- Designed for:
- Lead Project
- Project ID:
- Development company
- Date:
- PCB Revision:
- PCB Name:
- Sheet Title:
- Assembly Variant:
- Time:
- Sheet
- of
- Engineer SCH:
- Engineer PCB:
- Inspection PRJ:
- Size: A3
- File:
- (in symbol TANTAL-B 100uF 6.3V (B)) TB

### Library data of the parts
C1 C3 C4 = 0603 0.1 uF (B): as C24 on sheet Display; Case/Package: 0603; Publisher: Catcatcat Electronics; Tolerance: ±10%; HelpURL: https://datasheet.lcsc.com/lcsc/1809301912_YAGEO-CC0603KRX7R9BB104_C14663.pdf; website developer: http://catcatcat.d-lan.dp.ua/; Temperature Coefficient: X7R; Supplier URL 1: https://jlcpcb.com/parts/componentSearch?searchTxt=; Operating Temperature: -55C to +125C; Supplier Part Number 1: C14663; Supplier Unit Price 1: 0.0021; Assembly type: Basic Part; Footprint check status: Verified; QuantityElements: 1; Supplier 1: LCSC; MountType: SMD
C2 = 0603 0.01 uF (B): 10 nF ±10% 50V X7R; Manufacturer 1: Guangdong Fenghua Advanced Tech; Manufacturer Part Number 1: 0603B103K500NT; Note: Ceramic Capacitors; Detailed Description: 50V 10nF X7R ±10% 0603  Multilayer Ceramic Capacitors MLCC - SMD/SMT ROHS; Case/Package: 0603; Publisher: Catcatcat Electronics; Tolerance: ±10%; HelpURL: https://datasheet.lcsc.com/szlcsc/Guangdong-Fenghua-Advanced-Tech-0603B103K500NT_C57112.pdf; Website Developer: http://catcatcat.d-lan.dp.ua/; Temperature Coefficient: X7R; Supplier URL 1: https://jlcpcb.com/parts/componentSearch?searchTxt=; Operating Temperature: -55C to +125C; Supplier Part Number 1: C57112; Supplier Unit Price 1: 0.0012; Assembly type: Basic Part; Footprint check status: Verified; QuantityElements: 1; Supplier 1: LCSC; MountType: SMD
C5 = TANTAL-B 100uF 6.3V (B): as C18 on sheet Display; Case/Package: CASE-B_3528; Publisher: Catcatcat Electronics; Note: Tantalum Capacitors; HelpURL: https://datasheet.lcsc.com/szlcsc/AVX-TAJB107K006RNJ_C16133.pdf; website developer: http://catcatcat.d-lan.dp.ua/; Detailed Description: Tantalum Capacitors 100uF 6.3V CASE-B_3528 RoHS; Supplier URL 1: https://jlcpcb.com/parts/componentSearch?searchTxt=; Supplier Part Number 1: C16133; Supplier Unit Price 1: 0.1177; Assembly type: Basic Part; Footprint check status: Verified; QuantityElements: 1; Supplier 1: LCSC; MountType: SMD
FB1 = 0603 GZ1608D601TF (B): 0.20A 600 Ohm @100MHz 450 mOhm; Manufacturer 1: Sunlord; Temp.Characteristic: -55°C ~ 125°C; Note: Ferrite Beads and Chips; Detailed Description: 450mΩ ±25% 600Ω@100MHz 0603  Ferrite Beads ROHS; Case/Package: 0603; Publisher: Catcatcat Electronics; HelpURL: https://datasheet.lcsc.com/lcsc/1811091241_Sunlord-GZ1608D601TF_C1002.pdf; website developer: http://catcatcat.d-lan.dp.ua/; Manufacturer Part Number 1: GZ1608D601TF; Supplier URL 1: https://jlcpcb.com/parts/componentSearch?searchTxt=; Supplier Part Number 1: C1002; Supplier Unit Price 1: 0.0045; Assembly type: Basic Part; Footprint check status: Verified; QuantityElements: 1; Supplier 1: LCSC; MountType: SMD
LD1 = KT-0603R (B): 0603 Red 520~625NM 90~100MCD@20MA Top View RoHS; Manufacturer 1: Hubei KENTO Elec; Note: LED Red; Temp.Characteristic: -40C to +85C; Detailed Description: -40℃~+85℃ Red 0603  Light Emitting Diodes (LED) ROHS; Millicandela Rating: 30~50mcd@5mA; Wavelength(Range or typical): 619~625nm; Publisher: Catcatcat Electronics; Manufacturer Part Number 1: KT-0603R; Supplier URL 1: https://www.lcsc.com/product-detail/Light-Emitting-Diodes-LED_Hubei-KENTO-Elec-KT-0603R_C2286.html; Operating Temperature: -40°C~+85°C; Supplier Part Number 1: C2286; Supplier Unit Price 1: 0.0053; HelpURL: https://datasheet.lcsc.com/szlcsc/Hubei-KENTO-Elec-KT-0603R_C2286.pdf; Website developer: http://catcatcat.d-lan.dp.ua/; Assembly type: Basic Part; Footprint check status: Verified; QuantityElements: 1; Supplier 1: LCSC; MountType: SMD
LD2 = 19-213/Y2C-CQ2R2L/3T(CY) (B): 0603 Yellow Colorless transparence -40℃~+85℃ 585.5nm~591.5nm yellow 120° 60mW 0603  Light Emitting Diodes (LED) ROHS; Manufacturer 1: Everlight Elec; Temp.Characteristic: -40C to +85C; Millicandela Rating: 90~180mcd@20mA; Wavelength(Range or typical): 585.5~591.5nm; Publisher: Catcatcat Electronics; Note: Light Emitting Diodes; Manufacturer Part Number 1: 19-213/Y2C-CQ2R2L/3T(CY); Detailed Description: Colorless transparence -40℃~+85℃ 585.5nm~591.5nm yellow 120° 60mW 0603  Light Emitting Diodes (LED) ROHS; Supplier URL 1: https://www.lcsc.com/product-detail/Light-Emitting-Diodes-LED_Everlight-Elec-19-213-Y2C-CQ2R2L-3T-CY_C72038.html; Supplier Part Number 1: C72038; Supplier Unit Price 1: 0.0195; HelpURL: https://datasheet.lcsc.com/lcsc/1810101813_Everlight-Elec-19-213-Y2C-CQ2R2L-3T-CY_C72038.pdf; Website developer: http://catcatcat.d-lan.dp.ua/; Assembly type: Basic Part; Footprint check status: Verified; QuantityElements: 1; Supplier 1: LCSC; MountType: SMD
MCU1 = PIC18F27Q84-I/SS (E): SSOP-28, 128KB 1.8V~5.5V PIC 64MHz 25 SSOP-28-208mil Microcontroller Units (MCUs/MPUs/SOCs) ROHS; Manufacturer 1: Microchip Tech; Temp.Characteristic: -40C to +85C; Supplier Unit Price 1: 3.1065; Note: Microcontroller; Voltage: 1.8V~5.5V; HelpURL: https://ww1.microchip.com/downloads/aemDocuments/documents/MCU08/ProductDocuments/DataSheets/PIC18F27-47-57Q84-Data-Sheet-40002213D.pdf; Manufacturer Part Number 1: PIC18F27Q84-I/SS; Website Developer: http://catcatcat.d-lan.dp.ua/; Detailed Description: SSOP-28-208mil  Microcontroller Units (MCUs/MPUs/SOCs) ROHS; Speed: 64MHz; Case/Package: SSOP-28-208mil; Supplier URL 1: https://www.lcsc.com/product-detail/Microcontroller-Units-MCUs-MPUs-SOCs_Microchip-Tech-PIC18F27Q84-I-SS_C2987163.html; Manufacturer URL: https://www.microchip.com/en-us/product/PIC18F27Q84; Operating Temperature: -40℃~+85℃; Supplier Part Number 1: C2987163; Publisher: Catcatcat Electronics; Assembly type: Extended Part; Footprint check status: Verified; QuantityElements: 1; Supplier 1: LCSC; MountType: SMD; ECCN: EAR99; Value: PIC18F27Q84-I/SS
R1 R6 = 0603 10 kOhm ±1% (B): 10 k (103) ±1% 1/10W; Manufacturer 1: Uniroyal Elec; Manufacturer Part Number 1: 0603WAF1002T5E; Voltage: 50V; Note: Chip Resistor - Surface Mount; Marking: 103; Temperature Coefficient: ±100ppm/°C; Detailed Description: CHIP RESISTOR - SURFACE MOUNT 10KOHMS ±1% 1/10W 0603 ROHS; Publisher: Catcatcat Electronics; Tolerance: ±1%; HelpURL: https://datasheet.lcsc.com/szlcsc/Uniroyal-Elec-0603WAF1002T5E_C25804.pdf; Website Developer: http://catcatcat.d-lan.dp.ua/; Power (Watts): 1/10W; Supplier URL 1: https://jlcpcb.com/parts/componentSearch?searchTxt=C25804; Operating Temperature: -55°C ~ 155°C; Supplier Part Number 1: C25804; Supplier Unit Price 1: 0.0008; Assembly type: Basic Part; Footprint check status: Verified; QuantityElements: 1; Supplier 1: LCSC; MountType: SMD; Case/Package: 0603
R2 R4 R5 R7-R9 R12 R13 R16-R19 = 0603 1 kOhm ±1% (B): 1 k (01B) ±1% 1/10W; Manufacturer 1: Uniroyal Elec; Manufacturer Part Number 1: 0603WAF1001T5E; Voltage: 75V; Note: Chip Resistor - Surface Mount; Marking: 102; Temperature Coefficient: ±100ppm/°C; Detailed Description: 100mW Thick Film Resistors ±100ppm/℃ ±1% 1kΩ 0603  Chip Resistor - Surface Mount ROHS; Publisher: Catcatcat Electronics; Tolerance: ±1%; HelpURL: https://datasheet.lcsc.com/szlcsc/Uniroyal-Elec-0603WAF1001T5E_C21190.pdf; Website Developer: http://catcatcat.d-lan.dp.ua/; Power (Watts): 1/10W; Supplier URL 1: https://jlcpcb.com/parts/componentSearch?searchTxt=; Operating Temperature: -55°C ~ 155°C; Supplier Part Number 1: C21190; Supplier Unit Price 1: 0.0005; Assembly type: Basic Part; Footprint check status: Verified; QuantityElements: 1; Supplier 1: LCSC; MountType: SMD; Case/Package: 0603
R3 = 0603 33 Ohm ±1% (B): 33 R (330) ±1% 1/10W 50V; Manufacturer 1: Uniroyal Elec; Manufacturer Part Number 1: 0603WAF330JT5E; Note: Chip Resistor - Surface Mount; Temperature Coefficient: ±100ppm/°C; Detailed Description: CHIP RESISTOR - SURFACE MOUNT 33OHMS ±1% 1/10W 0603 ROHS; Publisher: Catcatcat Electronics; Tolerance: ±1%; Voltage: 50V; HelpURL: https://datasheet.lcsc.com/szlcsc/Uniroyal-Elec-0603WAF330JT5E_C23140.pdf; Website Developer: http://catcatcat.d-lan.dp.ua/; Power (Watts): 1/10W; Supplier URL 1: https://jlcpcb.com/parts/componentSearch?searchTxt=; Operating Temperature: -55°C ~ 155°C; Supplier Part Number 1: C23140; Supplier Unit Price 1: 0.0014; Assembly type: Basic Part; Footprint check status: Verified; QuantityElements: 1; Supplier 1: LCSC; MountType: SMD; Case/Package: 0603
R10 R11 = 0603 22 Ohm ±1% (B): 22 R (220) ±1% 1/10W 50V; Manufacturer 1: Uniroyal Elec; Manufacturer Part Number 1: 0603WAF220JT5E; Note: Chip Resistor - Surface Mount; Temperature Coefficient: ±100ppm/°C; Detailed Description: 100mW Thick Film Resistors ±100ppm/℃ ±1% 22Ω 0603  Chip Resistor - Surface Mount ROHS; Publisher: Catcatcat Electronics; Tolerance: ±1%; Voltage: 50V; HelpURL: Uniroyal-Elec-0603WAF220JT5E_C23345.pdf; Website Developer: http://catcatcat.d-lan.dp.ua/; Power (Watts): 1/10W; Supplier URL 1: https://jlcpcb.com/parts/componentSearch?searchTxt=; Operating Temperature: -55°C ~ 155°C; Supplier Part Number 1: C23345; Supplier Unit Price 1: 0.0009; Assembly type: Basic Part; Footprint check status: Verified; QuantityElements: 1; Supplier 1: LCSC; MountType: SMD; Case/Package: 0603
R14 R15 = 0603 2.2 kOhm ±1% (B): 2.2 k (222) ±1% 1/10W 50V; Manufacturer 1: Uniroyal Elec; Manufacturer Part Number 1: 0603WAF2201T5E; Note: Chip Resistor - Surface Mount; Marking: 222; Temperature Coefficient: ±100ppm/℃; Detailed Description: 100mW Thick Film Resistors ±100ppm/℃ ±1% 2.2kΩ 0603  Chip Resistor - Surface Mount ROHS; Publisher: Catcatcat Electronics; Tolerance: ±1%; Voltage: 50V; HelpURL: https://datasheet.lcsc.com/szlcsc/Uniroyal-Elec-0603WAF2201T5E_C4190.pdf; Website Developer: http://catcatcat.d-lan.dp.ua/; Power (Watts): 1/10W; Supplier URL 1: https://jlcpcb.com/parts/componentSearch?searchTxt=; Operating Temperature: -55°C ~ 155°C; Supplier Part Number 1: C4190; Supplier Unit Price 1: 0.0009; Assembly type: Basic Part; Footprint check status: Verified; QuantityElements: 1; Supplier 1: LCSC; MountType: SMD; Case/Package: 0603
TP1 TP2 = Test_Point smd_0.6: Test Point TOP; Value: SMD; Assembly type: Test Point; Note: Test Point; Publisher: Catcatcat Electronics; Website developer: http://catcatcat.d-lan.dp.ua/; Footprint check status: Verified; Supplier URL 1: https://jlcpcb.com/parts/componentSearch?searchTxt=; Supplier 1: LCSC
X1 = PL2N-05n: 2.0 mm; Value: 5*2mm; Note: Connector; Temp.Characteristic: -40C to +85C; Supplier URL 1: https://jlcpcb.com/parts/componentSearch?searchTxt=; Publisher: Catcatcat Electronics; Manufacturer 1: http://www.jinlingdz.com; Website Developer: http://catcatcat.d-lan.dp.ua/; Assembly type: Manual Part; Footprint check status: Verified; QuantityElements: 1; Operating Temperature: -40℃~+105℃; MountType: TH

## Sheet Touch Sensors.SchDoc: =SheetTitle
size A4; CompanyName: Catcatcat Electronics; Engineer: Hena Chernov; Organization: Catcatcat Electronics; SheetNumber: 9; SheetTotal: 10; CodePhone: +380505759863; SheetDescription: Capacitive touch buttons.; Email: catcatcat.electronics@gmail.com
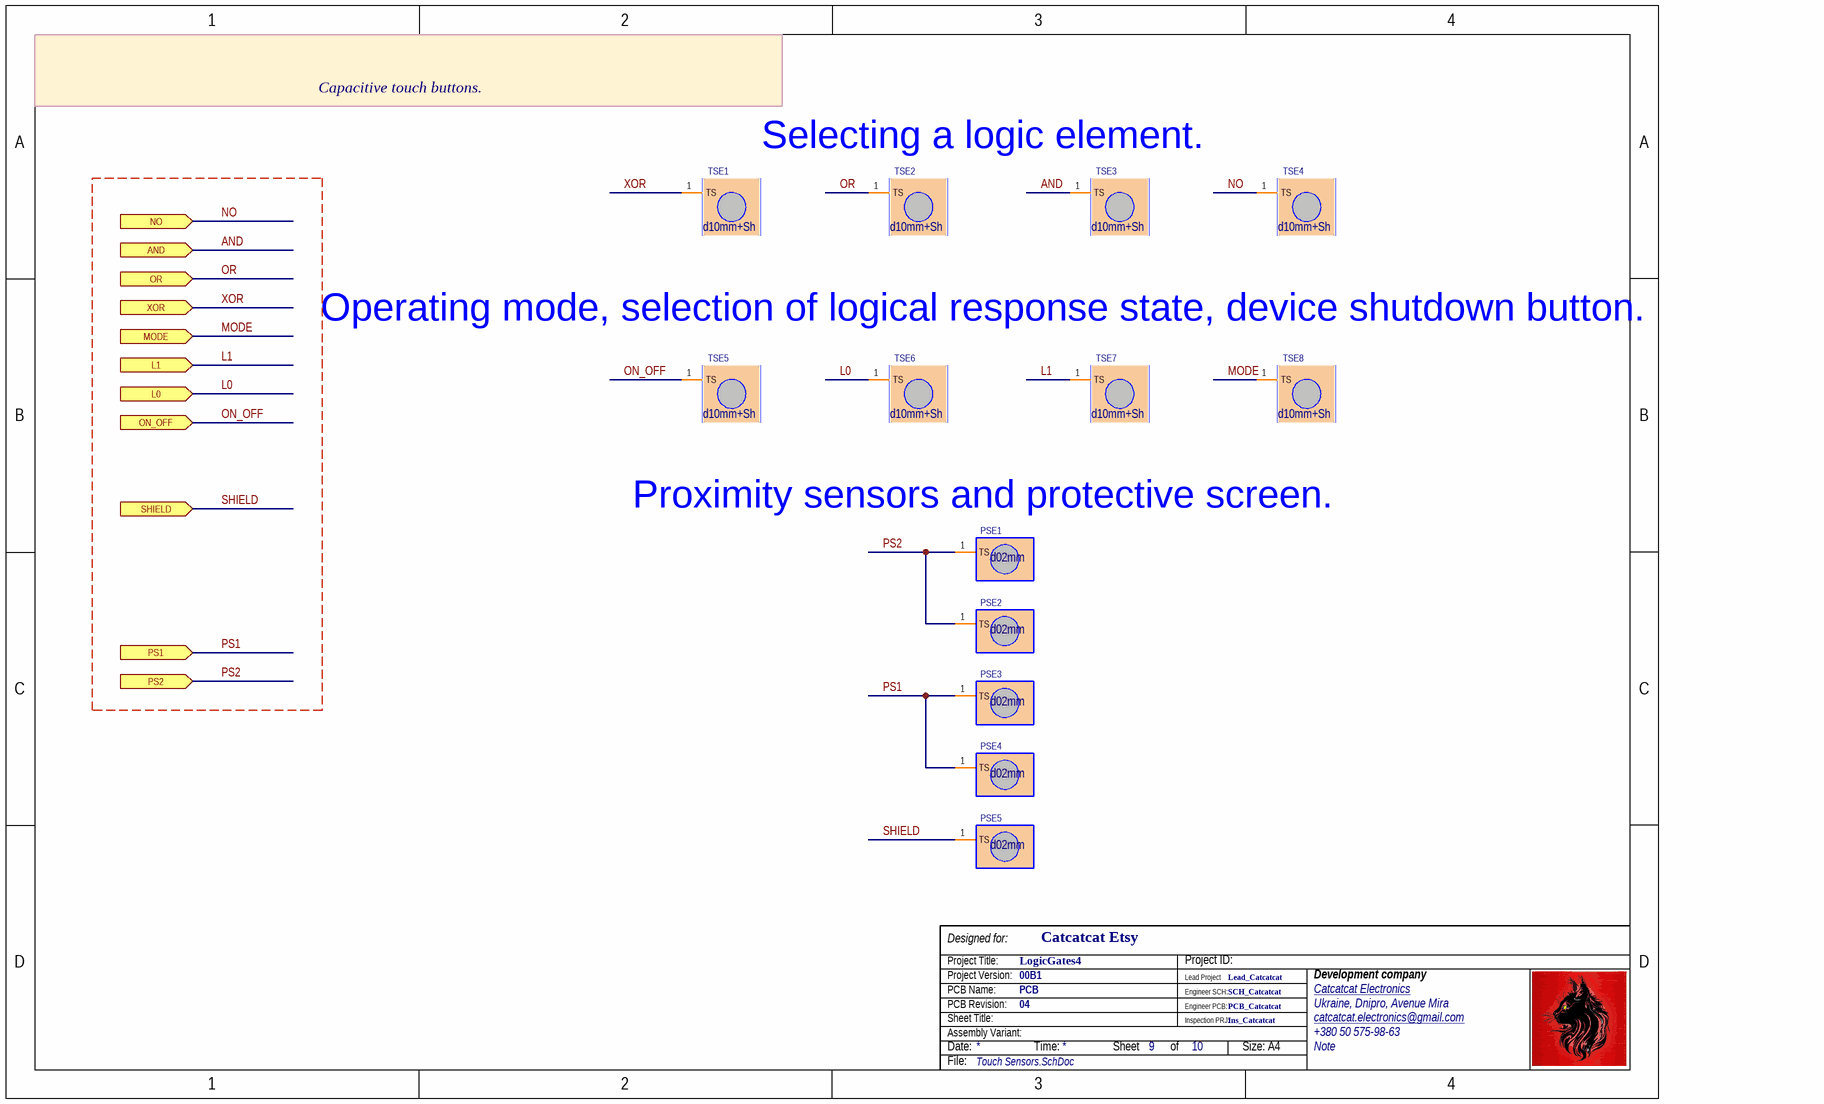
[diagram p6: Touch Sensors.SchDoc]

### Parts
PSE1  Connection point  [Connection point]  (value not drawn)  (no BOM)
PSE2  Connection point  [Connection point]  (value not drawn)  (no BOM)
PSE3  Connection point  [Connection point]  (value not drawn)  (no BOM)
PSE4  Connection point  [Connection point]  (value not drawn)  (no BOM)
PSE5  Connection point  [Connection point]  (value not drawn)  (no BOM)
TSE1  Touch Sensors d10mm_Z  [Circle d10mm_NOV1]  (value not drawn)  (no BOM)
TSE2  Touch Sensors d10mm_Z  [Circle d10mm_NOV1]  (value not drawn)  (no BOM)
TSE3  Touch Sensors d10mm_Z  [Circle d10mm_NOV1]  (value not drawn)  (no BOM)
TSE4  Touch Sensors d10mm_Z  [Circle d10mm_NOV1]  (value not drawn)  (no BOM)
TSE5  Touch Sensors d10mm_Z  [Circle d10mm_NOV1]  (value not drawn)  (no BOM)
TSE6  Touch Sensors d10mm_Z  [Circle d10mm_NOV1]  (value not drawn)  (no BOM)
TSE7  Touch Sensors d10mm_Z  [Circle d10mm_NOV1]  (value not drawn)  (no BOM)
TSE8  Touch Sensors d10mm_Z  [Circle d10mm_NOV1]  (value not drawn)  (no BOM)

### Ports
AND (in), L0 (in), L1 (in), MODE (in), NO (in), ON_OFF (in), OR (in), PS1 (in), PS2 (in), SHIELD (in), XOR (in)

### Nets
AND: TSE3.1(TS) ; port AND
L0: TSE6.1(TS) ; port L0
L1: TSE7.1(TS) ; port L1
MODE: TSE8.1(TS) ; port MODE
NO: TSE4.1(TS) ; port NO
ON_OFF: TSE5.1(TS) ; port ON_OFF
OR: TSE2.1(TS) ; port OR
PS1: PSE3.1(TS) PSE4.1(TS) ; port PS1
PS2: PSE1.1(TS) PSE2.1(TS) ; port PS2
SHIELD: PSE5.1(TS) ; port SHIELD
XOR: TSE1.1(TS) ; port XOR

### Notes on the sheet
- Selecting a logic element.
- Operating mode, selection of logical response state, device shutdown button.
- (near PSE1) Proximity sensors and protective screen.
- Project Title:
- Project Version:
- Designed for:
- Lead Project
- Project ID:
- Development company
- Date:
- PCB Revision:
- PCB Name:
- Sheet Title:
- Assembly Variant:
- Time:
- Sheet
- of
- Engineer SCH:
- Engineer PCB:
- Inspection PRJ:
- Size: A4
- File:
- (in symbol Connection point) d02mm
- (in symbol Touch Sensors d10mm_Z) d10mm+Sh

### Library data of the parts
PSE1-PSE5 = Connection point: Proximity sensor,; Value: *; Assembly type: PCB component; Case/Package: d2mm; Publisher: Catcatcat Electronics; Website Developer: http://catcatcat.d-lan.dp.ua/; Footprint check status: Verified
TSE1-TSE8 = Touch Sensors d10mm_Z: Touch Sensors,; Value: *; Assembly type: PCB component; Case/Package: d10mm; Publisher: Catcatcat Electronics; Website Developer: http://catcatcat.d-lan.dp.ua/; Footprint check status: Verified